# EAGLE design v2RespiratorCOVID19 (EAGLE 7.7.0)
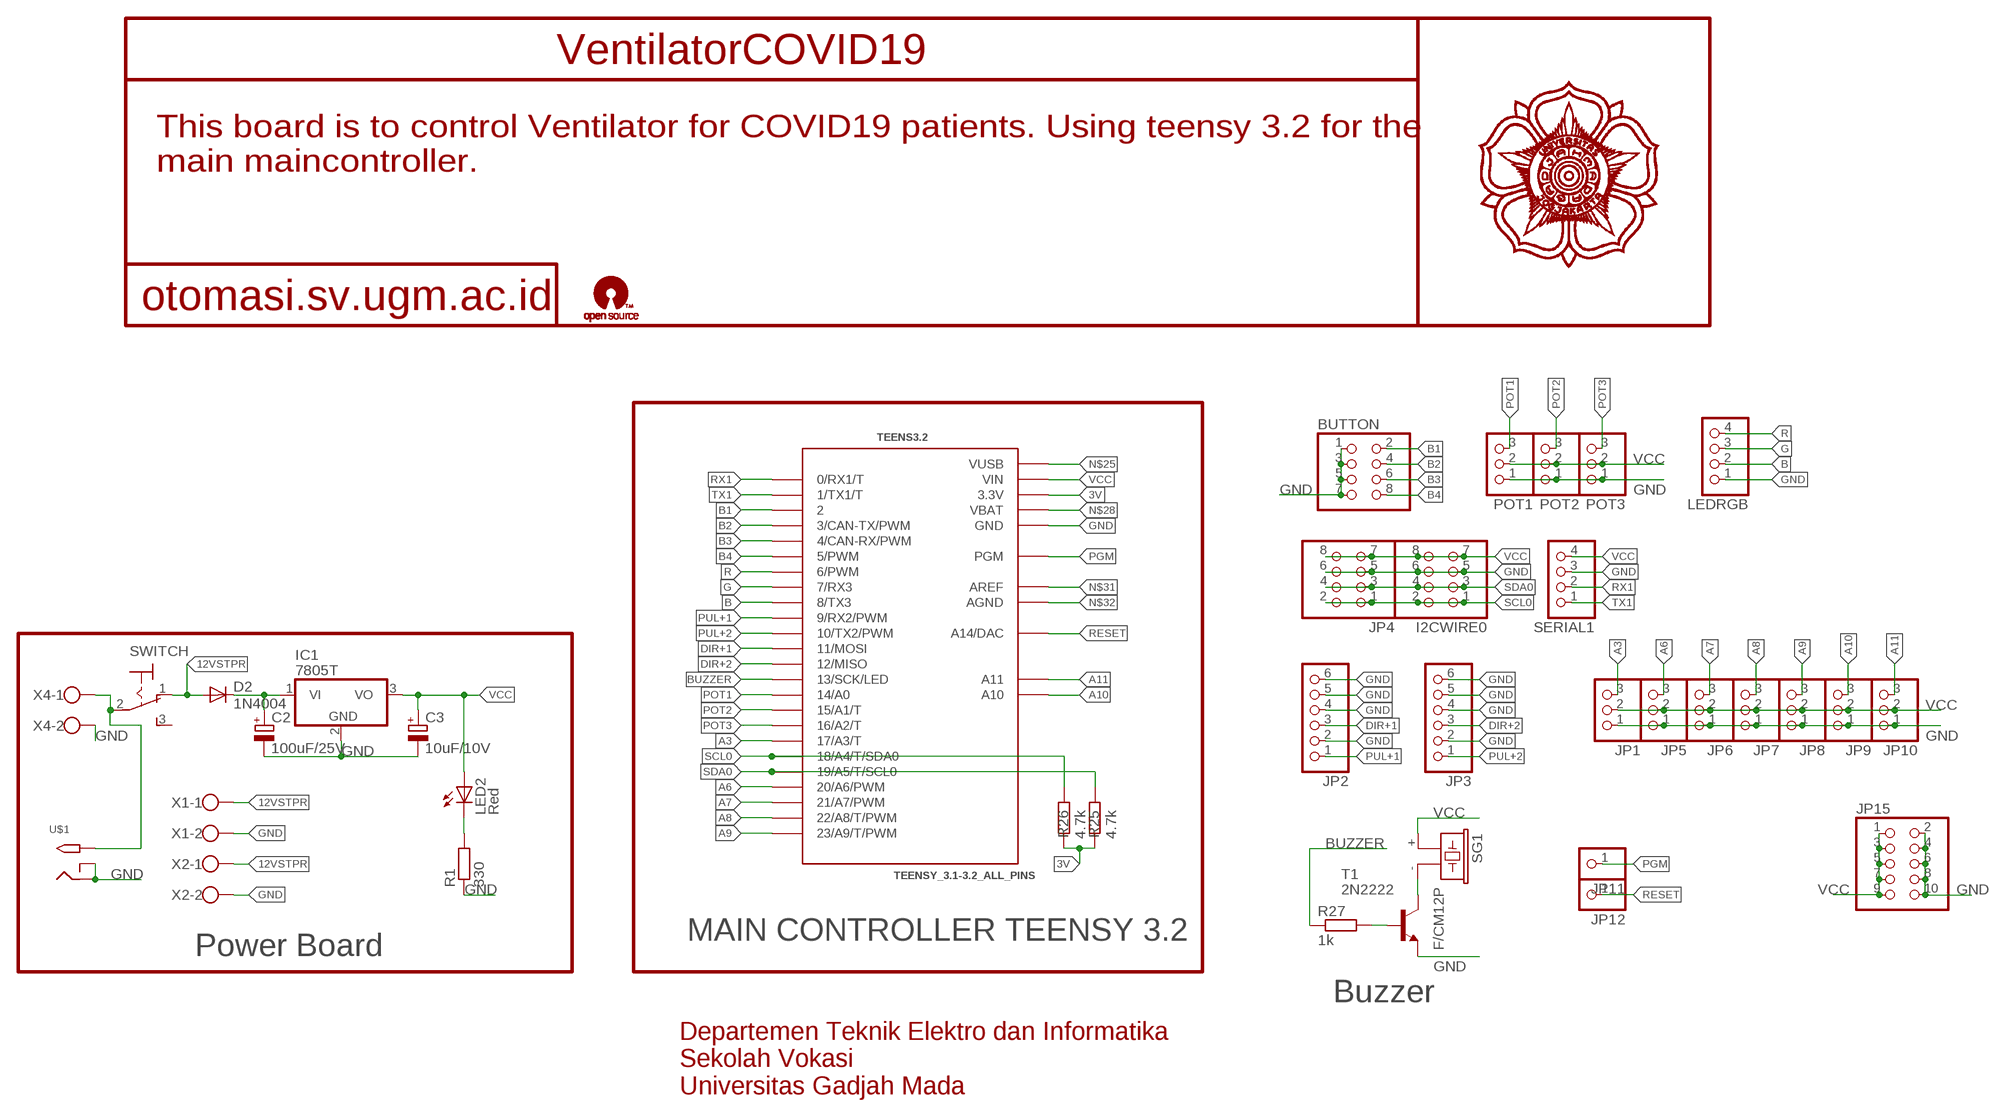
[diagram p0: schematic, sheet 1]

## Parts
BUTTON  PINHD-2X4  [2X04]
C2  100uF/25V  CPOL-EUE5-8.5  [E5-8,5]
C3  10uF/10V  CPOL-EUE5-8.5  [E5-8,5]
D2  1N4004  [DO41-10]
I2CWIRE0  PINHD-2X4  [2X04]
IC1  7805T  [TO220H]
JP1  PINHD-1X3  [1X03]
JP2  PINHD-1X6  [1X06]
JP3  PINHD-1X6  [1X06]
JP4  PINHD-2X4  [2X04]
JP5  PINHD-1X3  [1X03]
JP6  PINHD-1X3  [1X03]
JP7  PINHD-1X3  [1X03]
JP8  PINHD-1X3  [1X03]
JP9  PINHD-1X3  [1X03]
JP10  PINHD-1X3  [1X03]
JP11  PINHD-1X1  [1X01]
JP12  PINHD-1X1  [1X01]
JP15  PINHD-2X5  [2X05]
LED2  Red  LED3MM  [LED3MM]
LEDRGB  PINHD-1X4  [1X04]
POT1  PINHD-1X3  [1X03]
POT2  PINHD-1X3  [1X03]
POT3  PINHD-1X3  [1X03]
R1  330  R-EU_R1206  [R1206]
R25  4.7k  R-EU_R1206  [R1206]
R26  4.7k  R-EU_R1206  [R1206]
R27  1k  R-EU_R1206  [R1206]
SERIAL1  PINHD-1X4  [1X04]
SG1  F/CM12P  [F/CM12P]
SWITCH  M9040P  [M9040P]
T1  2N2222  [TO92-EBC-OVAL]
TEENS3.2  TEENSY_3.1-3.2_ALL_PINS  [TEENSY_3.0-3.2&LC_ALL_PINS]
U$1  2.1MMJACKTHM  [PJ-102A]
X1  W237-102  [W237-102]
X2  W237-102  [W237-102]
X4  W237-102  [W237-102]

## Nets
3V: R25.2 R26.2 TEENS3.2.3.3V TEENS3.2.3.3V1(3.3V)
12VSTPR: D2.A SWITCH.1(O) X1.1 X2.1
A3: JP1.3 TEENS3.2.17/A3(17/A3/T)
A6: JP5.3 TEENS3.2.20/A6(20/A6/PWM)
A7: JP6.3 TEENS3.2.21/A7(21/A7/PWM)
A8: JP7.3 TEENS3.2.22/A8(22/A8/T/PWM)
A9: JP8.3 TEENS3.2.23/A9(23/A9/T/PWM)
A10: JP9.3 TEENS3.2.A10
A11: JP10.3 TEENS3.2.A11
B: LEDRGB.2 TEENS3.2.8(8/TX3)
B1: BUTTON.2 TEENS3.2.2
B2: BUTTON.4 TEENS3.2.3(3/CAN-TX/PWM)
B3: BUTTON.6 TEENS3.2.4(4/CAN-RX/PWM)
B4: BUTTON.8 TEENS3.2.5(5/PWM)
BUZZER: R27.1 TEENS3.2.13(13/SCK/LED)
DIR+1: JP2.3 TEENS3.2.11(11/MOSI)
DIR+2: JP3.3 TEENS3.2.12(12/MISO)
G: LEDRGB.3 TEENS3.2.7(7/RX3)
GND: BUTTON.1 BUTTON.3 BUTTON.5 BUTTON.7 C2.- C3.- I2CWIRE0.5 I2CWIRE0.6 IC1.2(GND) JP1.1 JP2.2 JP2.4 JP2.5 JP2.6 JP3.2 JP3.4 JP3.5 JP3.6 JP4.5 JP4.6 JP5.1 JP6.1 JP7.1 JP8.1 JP9.1 JP10.1 JP15.2 JP15.4 JP15.6 JP15.8 JP15.10 LEDRGB.1 POT1.1 POT2.1 POT3.1 R1.1 SERIAL1.3 T1.E TEENS3.2.GND TEENS3.2.GND1(GND) U$1.RING U$1.RING_SW X1.2 X2.2 X4.2
N$25: TEENS3.2.VUSB
N$28: TEENS3.2.VBAT
N$31: TEENS3.2.AREF
N$32: TEENS3.2.AGND
N$36: R27.2 T1.B
N$37: C2.+ D2.C IC1.1(VI)
N$38: SG1.- T1.C
N$39: LED2.K(C) R1.2
N$40: SWITCH.2(P) U$1.TIP X4.1
PGM: JP11.1 TEENS3.2.PGM
POT1: POT1.3 TEENS3.2.14/A0
POT2: POT2.3 TEENS3.2.15/A1(15/A1/T)
POT3: POT3.3 TEENS3.2.16/A2(16/A2/T)
PUL+1: JP2.1 TEENS3.2.9(9/RX2/PWM)
PUL+2: JP3.1 TEENS3.2.10(10/TX2/PWM)
R: LEDRGB.4 TEENS3.2.6(6/PWM)
RESET: JP12.1 TEENS3.2.RESET/DAC(A14/DAC)
RX1: SERIAL1.2 TEENS3.2.0(0/RX1/T)
SCL0: I2CWIRE0.1 I2CWIRE0.2 JP4.1 JP4.2 R26.1 TEENS3.2.18/A4(18/A4/T/SDA0)
SDA0: I2CWIRE0.3 I2CWIRE0.4 JP4.3 JP4.4 R25.1 TEENS3.2.19/A5(19/A5/T/SCL0)
TX1: SERIAL1.1 TEENS3.2.1(1/TX1/T)
VCC: C3.+ I2CWIRE0.7 I2CWIRE0.8 IC1.3(VO) JP1.2 JP4.7 JP4.8 JP5.2 JP6.2 JP7.2 JP8.2 JP9.2 JP10.2 JP15.1 JP15.3 JP15.5 JP15.7 JP15.9 LED2.A POT1.2 POT2.2 POT3.2 SERIAL1.4 SG1.+ TEENS3.2.VIN
Unconnected: SWITCH.3(S)

## Notes on the sheet
- VentilatorCOVID19
- This board is to control Ventilator for COVID19 patients. Using teensy 3.2 for the
  main maincontroller.
- otomasi.sv.ugm.ac.id
- MAIN CONTROLLER TEENSY 3.2
- Power Board
- Buzzer
- Departemen Teknik Elektro dan Informatika
  Sekolah Vokasi
  Universitas Gadjah Mada

## Library data of the parts
BUTTON I2CWIRE0 JP4 = pinhead:PINHD-2X4: PIN HEADER
C2 C3 = rcl:CPOL-EU: POLARIZED CAPACITOR, European symbol
D2 = diode:1N4004: DIODE general purpose rectifier, 1 A
IC1 = linear:78*: Positive VOLTAGE REGULATOR Source: http://cache.national.com/ds/LM/LM78L05.pdf http://www.fairchildsemi.com/ds/LM/LM7805.pdf
JP1 JP5-JP10 = pinhead:PINHD-1X3: PIN HEADER
JP2 JP3 = pinhead:PINHD-1X6: PIN HEADER
JP11 JP12 = adafruit:PINHD-1X1: Pin header 1x1 for 0.1" spacing With round pins
JP15 = pinhead:PINHD-2X5: PIN HEADER
LED2 = led:LED: LED OSRAM: - CHIPLED LG R971, LG N971, LY N971, LG Q971, LY Q971, LO R971, LY R971 LH N974, LH R974 LS Q976, LO Q976, LY Q976 LO Q996 - Hyper CHIPLED LW Q18S LB Q993, LB Q99A, LB R99A - SideLED LS A670, LO A670, LY A670, LG A670, LP A670 LB A673, LV A673, LT A673, LW A673 LH A674 LY A675 LS A676, LA A676, LO A676, LY A676, LW A676 LS A679, LY A679, LG A679 - Hyper Micro SIDELED® LS Y876, LA Y876, LO Y876, LY Y876 LT Y87S - SmartLED LW L88C, LW L88S LB L89C, LB L89S, LG L890 LS L89K, LO L89K, LY L89K LS L896, LA L896, LO L896, LY L896 - TOPLED LS T670, LO T670, LY T670, LG T670, LP T670 LSG T670, LSP T670, LSY T670, LOP T670, LYG T670 LG T671, LOG T671, LSG T671 LB T673, LV T673, LT T673, LW T673 LH T674 LS T676, LA T676, LO T676, LY T676, LB T676, LH T676, LSB T676, LW T676 LB T67C, LV T67C, LT T67C, LS T67K, LO T67K, LY T67K, LW E67C LS E67B, LA E67B, LO E67B, LY E67B, LB E67C, LV E67C, LT E67C LW T67C LS T679, LY T679, LG T679 LS T770, LO T770, LY T770, LG T770, LP T770 LB T773, LV T773, LT T773, LW T773 LH T774 LS E675, LA E675, LY E675, LS T675 LS T776, LA T776, LO T776, LY T776, LB T776 LHGB T686 LT T68C, LB T68C - Hyper Mini TOPLED® LB M676 - Mini TOPLED Santana® LG M470 LS M47K, LO M47K, LY M47K Source: http://www.osram.convergy.de LUXEON: - LUMILED® LXK2-PW12-R00, LXK2-PW12-S00, LXK2-PW14-U00, LXK2-PW14-V00 LXK2-PM12-R00, LXK2-PM12-S00, LXK2-PM14-U00 LXK2-PE12-Q00, LXK2-PE12-R00, LXK2-PE12-S00, LXK2-PE14-T00, LXK2-PE14-U00 LXK2-PB12-K00, LXK2-PB12-L00, LXK2-PB12-M00, LXK2-PB14-N00, LXK2-PB14-P00, LXK2-PB14-Q00 LXK2-PR12-L00, LXK2-PR12-M00, LXK2-PR14-Q00, LXK2-PR14-R00 LXK2-PD12-Q00, LXK2-PD12-R00, LXK2-PD12-S00 LXK2-PH12-R00, LXK2-PH12-S00 LXK2-PL12-P00, LXK2-PL12-Q00, LXK2-PL12-R00 Source: www.luxeon.com KINGBRIGHT: KA-3528ASYC Source: www.kingbright.com
LEDRGB SERIAL1 = pinhead:PINHD-1X4: PIN HEADER
POT1-POT3 = adafruit:PINHD-1X3: PIN HEADER
R1 R25-R27 = rcl:R-EU_: RESISTOR, European symbol
SG1 = buzzer:F/CM12P: BUZZER Source: Buerklin; OC_FARNELL: unknown; OC_NEWARK: unknown
SWITCH = switch:M9040P: TOGGLE SWITCH Marquardt
T1 = adafruit:2N2222: NPN TRANSISTOR Big oval pads
TEENS3.2 = Teensy_3_and_LC_Series_Boards_v1.4:TEENSY_3.1-3.2_ALL_PINS: Footprint for Teensy 3.1 or 3.2 board using all through-holes, i.e. the entire perimeter plus the 4 through-holes inboard (A10,A11,AREF, VUSB)
U$1 = adafruit:2.1MMJACK: 2.1mm x 5.5mm THM DC jack with internal switch. Digikey part #PJ-102A, 4UCON part #05537 2.1mm x 5.5mm SMT DC jack with internal switch. Digikey part #PJ-002A-SMT, 4UCON part #03267 By microbuilder.eu & adafruit.com
X1 X2 X4 = wago102:W237-102: WAGO SCREW CLAMP; MPN: 237-102; OC_FARNELL: unknown; OC_NEWARK: 70K9898

## Board
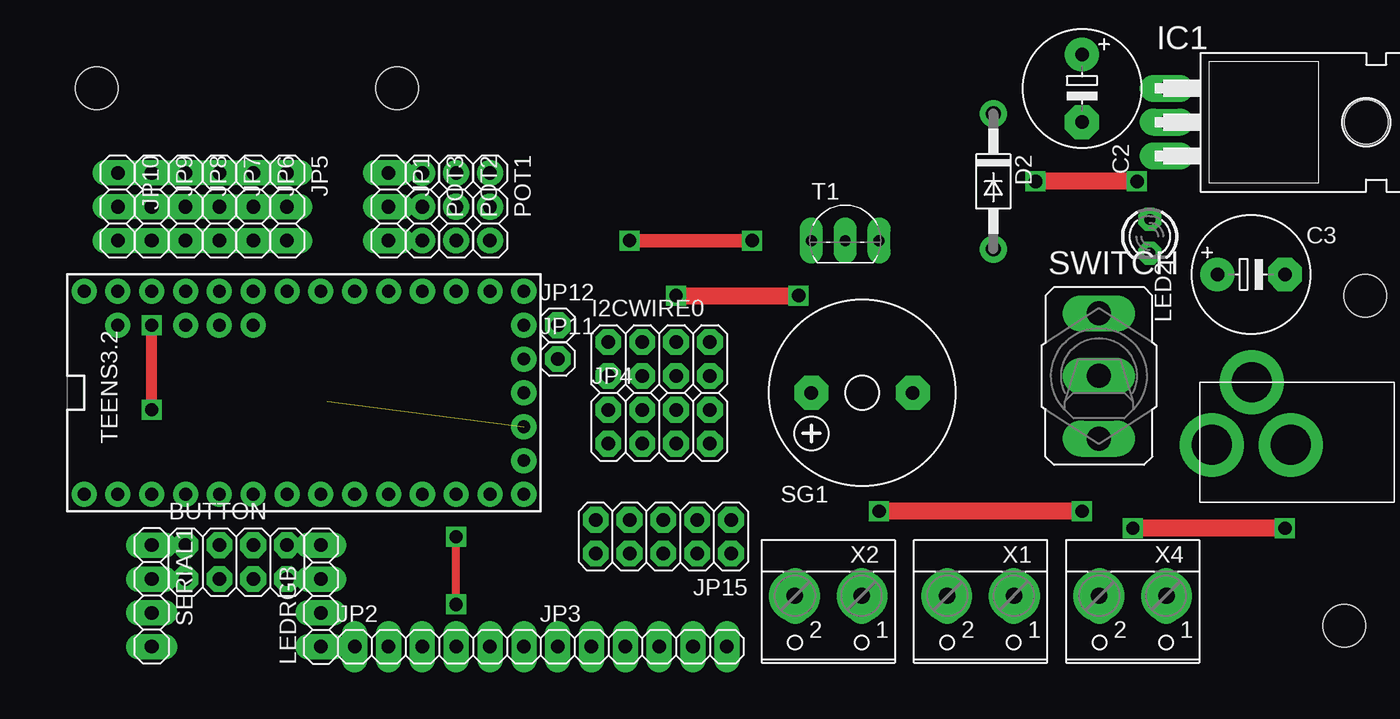
[diagram p1: board, top side]
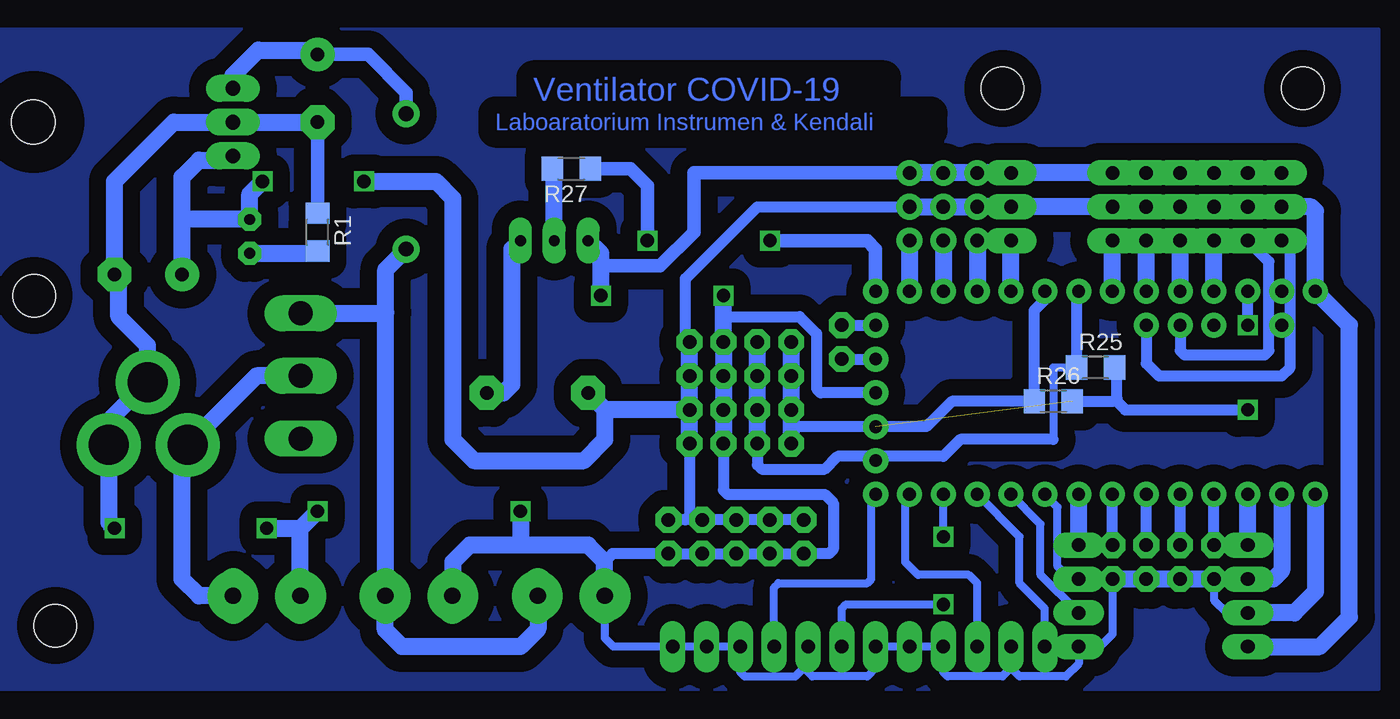
[diagram p2: board, bottom side, seen from below]

No outline drawn. Coordinates in mm, seen from the top.
Copper layers (1*16): Top 0.035mm / dielectric 1.5mm / Bottom 0.035mm
Design rules "default *": minimum track width 10mil, minimum drill 24mil, track to track 8mil, track to pad 8mil, pad to pad 8mil, via to via 8mil, smd to smd 8mil, copper to edge 40mil, drill to drill 8mil, minimum pad ring 18mil, minimum via ring 8mil, stop-mask expansion 4mil, vias tented up to drill 0mil, thermal gap 10mil
Holes 3.2 mm at 131.44,32.07 37.78,72.39 60.33,72.39 133.03,56.83

### Footprints (pad centres in the part's own frame; a part is rotated, then mirrored left to right if it is on the bottom)
2X04 = drill 1.016 octagon: 1 -3.81,-1.27; 2 -3.81,1.27; 3 -1.27,-1.27; 4 -1.27,1.27; 5 1.27,-1.27; 6 1.27,1.27; 7 3.81,-1.27; 8 3.81,1.27
E5-8,5 = drill 1.016 pad 2.54: + -2.54,0 | drill 1.016 pad 2.54 octagon: - 2.54,0
DO41-10 = drill 1.118: A 5.08,0; C -5.08,0
TO220H = drill 1.118 long: 1 -2.54,-10.16; 2 0,-10.16; 3 2.54,-10.16 | hole 3.302: 0,4.826
1X03 = drill 1.016 long: 1 -2.54,0; 2 0,0; 3 2.54,0
1X06 = drill 1.016 long: 1 -6.35,0; 2 -3.81,0; 3 -1.27,0; 4 1.27,0; 5 3.81,0; 6 6.35,0
1X01 = drill 1.016 pad 1.93 octagon: 1 0,0
2X05 = drill 1.016 octagon: 1 -5.08,-1.27; 2 -5.08,1.27; 3 -2.54,-1.27; 4 -2.54,1.27; 5 0,-1.27; 6 0,1.27; 7 2.54,-1.27; 8 2.54,1.27; 9 5.08,-1.27; 10 5.08,1.27
LED3MM = drill 0.813 octagon: A -1.27,0; K 1.27,0
1X04 = drill 1.016 long: 1 -3.81,0; 2 -1.27,0; 3 1.27,0; 4 3.81,0
1X03' = drill 1.016: 1 -2.54,0; 2 0,0; 3 2.54,0
R1206 = smd 1.6 x 1.803: 1 -1.422,0; 2 1.422,0
F/CM12P = drill 1.016 pad 2.54 octagon: + 3.81,0; - -3.81,0
M9040P = drill 1.803 long: 1 0,4.699; 2 0,0; 3 0,-4.699
TO92-EBC-OVAL = drill 0.813 long: B 0,-1.27; C 2.54,-1.27; E -2.54,-1.27
TEENSY_3.0-3.2&LC_ALL_PINS = drill 0.965: 0 -7.62,13.97; 1 -7.62,11.43; 2 -7.62,8.89; 3 -7.62,6.35; 3.3V 7.62,11.43; 3.3V1 -2.54,-16.51; 4 -7.62,3.81; 5 -7.62,1.27; 6 -7.62,-1.27; 7 -7.62,-3.81; 8 -7.62,-6.35; 9 -7.62,-8.89; 10 -7.62,-11.43; 11 -7.62,-13.97; 12 -7.62,-16.51; 13 7.62,-16.51; 14/A0 7.62,-13.97; 15/A1 7.62,-11.43; 16/A2 7.62,-8.89; 17/A3 7.62,-6.35; 18/A4 7.62,-3.81; 19/A5 7.62,-1.27; 20/A6 7.62,1.27; 21/A7 7.62,3.81; 22/A8 7.62,6.35; 23/A9 7.62,8.89; A10 5.08,6.35; A11 5.08,3.81; AGND 7.62,13.97; AREF 5.08,8.89; GND -7.62,16.51; GND1 0,-16.51; PGM 2.54,-16.51; RESET/DAC 5.08,-16.51; VBAT -5.08,-16.51; VIN 7.62,16.51; VUSB 5.08,13.97
PJ-102A = drill 3 pad 4.8: RING 0.1,-3.39; RING_SW -4.6,-6.29; TIP 0.1,-9.29
W237-102 = drill 1.194 long: 1 -2.5,-1.27; 2 2.5,-1.27 | drill 1.2 pad 3.81: 3 -2.54,-1.27; 4 2.54,-1.27

### Placement (x,y rotation side)
BUTTON  48.26,36.83 0 top
C2  111.76,72.39 270 top
C3  124.46,58.42 0 top
D2  105.09,65.41 270 top
I2CWIRE0  80.01,52.07 0 top
IC1  128.27,69.85 270 top
JP1  59.69,63.5 270 top
JP2  63.5,30.48 0 top
JP3  78.74,30.48 0 top
JP4  80.01,46.99 0 top
JP5  52.07,63.5 270 top
JP6  49.53,63.5 270 top
JP7  46.99,63.5 270 top
JP8  44.45,63.5 270 top
JP9  41.91,63.5 270 top
JP10  39.37,63.5 270 top
JP11  72.39,52.07 0 top
JP12  72.39,54.61 0 top
JP15  80.33,38.73 180 top
LED2  116.84,61.28 270 top
LEDRGB  54.61,34.29 90 top
POT1  [1X03']  67.31,63.5 270 top
POT2  [1X03']  64.77,63.5 270 top
POT3  [1X03']  62.23,63.5 270 top
R1  111.76,61.59 270 bottom
R25  53.34,51.44 0 bottom
R26  56.52,48.9 0 bottom
R27  92.71,66.36 180 bottom
SERIAL1  41.91,34.29 270 top
SG1  95.25,49.53 180 top
SWITCH  113.03,50.8 0 top
T1  93.98,62.23 0 top
TEENS3.2  53.34,49.53 90 top
U$1  130.81,45.72 270 top
X1  104.14,33.02 180 top
X2  92.71,33.02 180 top
X4  115.57,33.02 180 top

### Tracks (layer width: path | path; a pad name or v marks a point on that pad's centre or on a via)
3V  (via drill 1 pad 1.42)  (1 unrouted)
  Top 0.813: v41.91,48.26 v41.91,54.61
  Bottom 0.813: R26.2 52.07,48.9 51.75,49.21 | 51.75,49.21 51.75,51.27 R25.2 | 51.75,49.21 51.75,48.9 51.12,48.26 v41.91,48.26 | v41.91,54.61 TEENS3.2.3.3V
12VSTPR
  Bottom 1.27: X2.1 95.21,31.79 96.52,30.48 105.41,30.48 106.68,31.75 106.68,34.25 X1.1 106.64,55.56 | 106.64,55.56 106.64,58.78 D2.A | SWITCH.1 106.7,55.5 106.64,55.56
A3
  Bottom 1.27: TEENS3.2.17/A3 JP1.3
A6
  Bottom 1.27: TEENS3.2.20/A6 JP5.3
A7
  Bottom 1.27: TEENS3.2.21/A7 JP6.3
A8
  Bottom 1.27: TEENS3.2.22/A8 JP7.3
A9
  Bottom 1.27: TEENS3.2.23/A9 JP8.3
A10
  Bottom 0.813: TEENS3.2.A10 46.99,52.7 46.67,52.39 40.64,52.39 40.32,52.7 40.32,59.37 JP9.3
A11
  Bottom 0.813: TEENS3.2.A11 49.53,51.75 48.58,50.8 39.37,50.8 38.73,51.44 38.73,60.33 JP10.3
B
  Bottom 0.61: LEDRGB.2 57.47,35.88 57.47,39.69 TEENS3.2.8
B1
  Bottom 0.813: BUTTON.2 TEENS3.2.2
B2
  Bottom 0.813: BUTTON.4 TEENS3.2.3
B3
  Bottom 0.813: BUTTON.6 TEENS3.2.4
B4
  Bottom 0.813: BUTTON.8 TEENS3.2.5
BUZZER  (via drill 1 pad 1.42)
  Top 1.016: v77.79,60.96 v87,60.96
  Bottom 1.016: TEENS3.2.13 69.85,60.33 70.48,60.96 v77.79,60.96 | v87,60.96 87,65.09 88.27,66.36 R27.1
DIR+1
  Bottom 0.61: JP2.3 62.23,35.24 62.87,35.88 66.67,35.88 67.63,36.83 67.63,41.59 TEENS3.2.11
DIR+2
  Bottom 0.61: JP3.3 77.47,34.92 77.15,35.24 70.48,35.24 70.17,35.56 70.17,41.59 TEENS3.2.12
G
  Bottom 0.61: LEDRGB.3 55.24,35.56 56.2,36.51 56.2,40.96 TEENS3.2.7
GND  (via drill 1 pad 0.81, 1 pad 1.42)
  Top 1.27: v111.76,40.64 v96.52,40.64 | v127,39.37 v115.57,39.37 | v81.28,56.83 v90.49,56.83
  Bottom 0.61: 59.69,28.89 59.05,28.26 55.56,28.26 54.61,29.21 LEDRGB.1 53.02,30.48 52.07,31.43 BUTTON.7 | 75.25,28.89 74.61,28.26 70.48,28.26 69.85,28.89 JP2.6 JP2.5 JP2.4 64.77,28.57 64.45,28.26 60.33,28.26 59.69,28.89 | 75.25,28.89 75.25,30.16 JP3.2 | 75.25,28.89 75.88,28.26 79.69,28.26 80.01,28.57 JP3.4 JP3.5 JP3.6 89.53,30.48 90.17,31.11 90.17,34.25 X2.2 | JP2.2 59.69,28.89 | BUTTON.1 44.45,33.97 43.5,33.02 SERIAL1.3
  Bottom 0.813: TEENS3.2.GND1 73.98,49.53 74.3,49.85 74.3,53.98 75.56,55.24 81.28,55.24 | JP15.4 JP15.2 89.61,37.47 90.21,36.87 | JP15.4 JP15.6 JP15.8 JP15.10 73.34,37.47 73.03,37.78 73.03,41.27 73.66,41.91 80.96,41.91 81.28,42.23 JP4.5 | 82.87,37.78 JP15.4
  Bottom 1.016: POT1.1 83.5,66.04 83.5,61.59 86.04,59.05 90.17,59.05 90.49,58.74 | R1.1 C2.-
  Bottom 1.27: X2.2 90.21,36.87 91.44,38.1 96.52,38.1 | 96.52,38.1 100.33,38.1 101.6,36.83 101.6,34.33 X1.2 | X4.2 113.07,39.33 113.03,39.37 | 113.03,39.37 v111.76,40.64 | v96.52,40.64 96.52,38.1 | v127,39.37 127.42,39.79 U$1.RING 127.42,47.42 U$1.RING_SW 124.52,53.08 126.68,55.24 126.68,58.1 C3.- 127,65.41 122.56,69.85 IC1.2 C2.- | v115.57,39.37 113.03,39.37 | JP4.5 JP4.6 I2CWIRE0.5 I2CWIRE0.6 81.28,55.24 v81.28,56.83 | POT1.1 POT2.1 POT3.1 JP1.1 JP5.1 JP6.1 JP7.1 JP8.1 JP9.1 JP10.1 | BUTTON.1 BUTTON.3 BUTTON.5 BUTTON.7 | TEENS3.2.GND 36.83,34.61 38.42,33.02 SERIAL1.3 | v90.49,56.83 90.49,58.74 90.49,60.01 T1.E
N$1
  pour Bottom (isolate 1.27): 32.07,27.3 136.53,27.3 136.53,76.83 32.07,76.83
N$36
  Bottom 1.27: T1.B 93.98,66.21 R27.2
N$37
  Bottom 1.016: D2.C 105.09,72.07 107.95,74.93 C2.+
  Bottom 1.27: IC1.1 118.11,73.34 116.2,75.25 112.08,75.25 C2.+
N$38
  Bottom 1.27: SG1.- 97.79,49.53 97.16,50.16 97.16,60.33 T1.C
N$39
  Bottom 1.27: LED2.K 111.92,60.01 R1.2
N$40
  Bottom 1.27: X4.1 120.65,34.29 121.92,35.56 121.92,45.22 U$1.TIP 116.34,50.8 SWITCH.2
PGM
  Bottom 0.813: JP11.1 TEENS3.2.PGM
POT1
  Bottom 1.27: POT1.3 TEENS3.2.14/A0
POT2
  Bottom 1.27: POT2.3 TEENS3.2.15/A1
POT3
  Bottom 1.27: POT3.3 TEENS3.2.16/A2
PUL+1
  Bottom 0.61: JP2.1 57.15,33.34 59.05,35.24 59.05,38.73 TEENS3.2.9
PUL+2  (via drill 1 pad 1.42)
  Top 0.61: v64.77,33.66 v64.77,38.73
  Bottom 0.61: JP3.1 72.39,33.34 72.07,33.66 v64.77,33.66 | v64.77,38.73 TEENS3.2.10
R
  Bottom 1.27: LEDRGB.4 TEENS3.2.6
RESET
  Bottom 0.813: JP12.1 TEENS3.2.RESET/DAC
RX1
  Bottom 1.27: TEENS3.2.0 39.37,36.2 40.01,35.56 SERIAL1.2
SCL0
  Bottom 0.813: TEENS3.2.18/A4 57.15,56.52 57.94,55.73 R26.1 64.14,48.9 66.04,46.99 76.2,46.99
  Bottom 1.27: I2CWIRE0.2 I2CWIRE0.1 JP4.2 76.2,46.99 JP4.1
SDA0
  Bottom 0.61: R25.1 56.52,51.44 56.52,46.04
  Bottom 0.813: R25.1 54.76,57 TEENS3.2.19/A5 | 56.52,46.04 63.5,46.04 64.77,44.77 72.71,44.77 73.66,43.81 78.42,43.81 78.74,44.13 JP4.3
  Bottom 1.27: JP4.3 JP4.4 I2CWIRE0.3 I2CWIRE0.4
TX1
  Bottom 1.27: SERIAL1.1 TEENS3.2.1
VCC  (via drill 1 pad 1.42)
  Top 1.27: v115.89,65.41 v108.27,65.41
  Bottom 0.813: I2CWIRE0.8 84.14,53.66 84.14,58.1 78.74,63.5 POT1.2 | JP15.9 JP15.7 JP15.5 JP15.3 84.14,40.01 | 84.14,40.01 JP15.1 | JP4.7 83.82,40.32 84.14,40.01
  Bottom 1.27: POT1.2 POT2.2 POT3.2 JP1.2 JP5.2 JP6.2 JP7.2 JP8.2 JP9.2 JP10.2 37.15,63.5 36.83,63.18 TEENS3.2.VIN 34.29,54.61 34.29,32.7 36.51,30.48 SERIAL1.4 | JP4.7 JP4.8 | JP4.8 I2CWIRE0.7 I2CWIRE0.8 | C3.+ 121.92,62.23 | 121.92,62.23 121.92,65.72 120.65,66.99 118.43,66.99 IC1.3 | 121.92,62.23 121.6,62.55 LED2.A 116.84,64.45 v115.89,65.41 | JP4.8 90.17,48.26 | 90.17,48.26 SG1.+ | v108.27,65.41 102.87,65.41 101.6,64.14 101.6,46.04 100.01,44.45 91.76,44.45 90.17,46.04 90.17,48.26

### Text on the board
Bottom: Ventilator COVID-19 | Laboaratorium Instrumen & Kendali